# EAGLE design Interface_V1.0 (EAGLE 9.4.1)

## Sheet 1 of 2
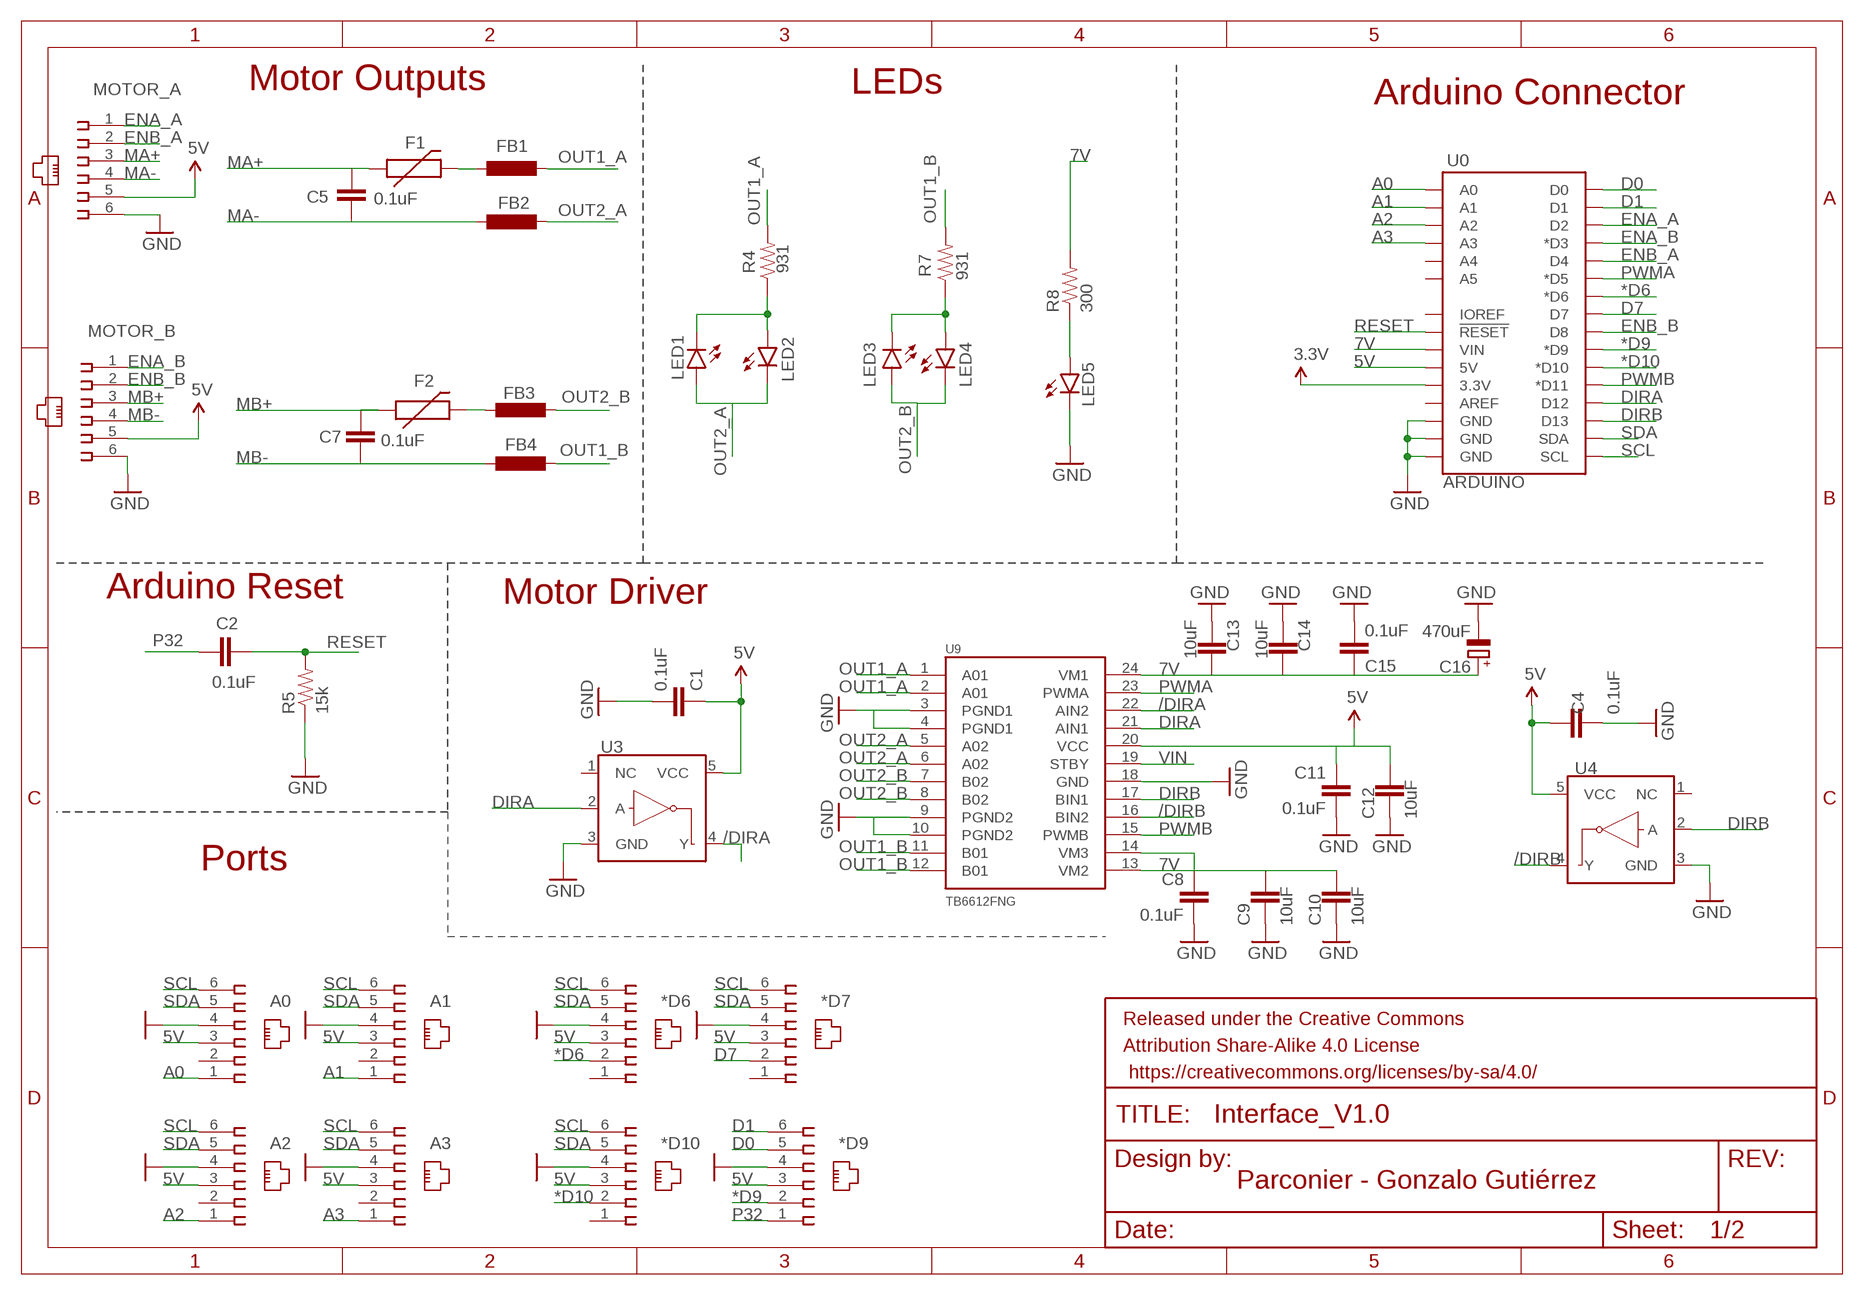
[diagram p0: schematic, sheet 1]

### Parts
*D6  615006138421  [615006138421]
*D7  615006138421  [615006138421]
*D9  615006138421  [615006138421]
*D10  615006138421  [615006138421]
A0  615006138421  [615006138421]
A1  615006138421  [615006138421]
A2  615006138421  [615006138421]
A3  615006138421  [615006138421]
C1  0.1uF  CAP_0402  [0402]
C2  0.1uF  CAP_0402  [0402]
C4  0.1uF  CAP_0402  [0402]
C5  0.1uF  CAP_0402  [0402]
C7  0.1uF  CAP_0402  [0402]
C8  0.1uF  CAP_0402  [0402]
C9  10uF  C-EUC0603  [C0603]
C10  10uF  C-EUC0603  [C0603]
C11  0.1uF  CAP_0402  [0402]
C12  10uF  C-EUC0603  [C0603]
C13  10uF  C-EUC0603  [C0603]
C14  10uF  C-EUC0603  [C0603]
C15  0.1uF  CAP_0402  [0402]
C16  470uF  CPOL-EUE  [PANASONIC_E]
F1  PTC  [PTC-1206]
F2  PTC  [PTC-1206]
FB1  FERRITE_BEAD  [F0805]
FB2  FERRITE_BEAD  [F0805]
FB3  FERRITE_BEAD  [F0805]
FB4  FERRITE_BEAD  [F0805]
LED1  LED0603  [LED-0603]
LED2  LED0603  [LED-0603]
LED3  LED0603  [LED-0603]
LED4  LED0603  [LED-0603]
LED5  LED0603  [LED-0603]
MOTOR_A  615006138421  [615006138421]
MOTOR_B  615006138421  [615006138421]
R4  931  RES_0402  [RESC1005X35]
R5  15k  RES_0402  [RESC1005X35]
R7  931  RES_0402  [RESC1005X35]
R8  300  RES_0402  [RESC1005X35]
U0  ARDUINO  ARDUINO_R3_NO_SPI  [ARDUINO_R3_NO_HOLES_SPI]
U3  INVERTER""  [SC70]
U4  INVERTER""  [SC70]
U9  TB6612FNG  [SSOP24]

### Nets
3.3V: U0.3.3V
5V: *D6.3 *D7.3 *D9.3 *D10.3 A0.3 A1.3 A2.3 A3.3 C1.1 C4.1 C11.1 C12.1 MOTOR_A.5 MOTOR_B.5 U0.5V U3.5(VCC) U4.5(VCC) U9.20(VCC)
7V: C8.1 C9.1 C10.1 C13.1 C14.1 C15.1 C16.+ R8.2 U0.VIN U9.13(VM2) U9.14(VM3) U9.24(VM1) ; also sheet 2
*D6: *D6.2 U0.D6(*D6)
*D9: *D9.2 U0.D9(*D9)
*D10: *D10.2 U0.D10(*D10)
/DIRA: U3.4(Y) U9.22(AIN2)
/DIRB: U4.4(Y) U9.16(BIN2)
A0: A0.1 U0.A0
A1: A1.1 U0.A1
A2: A2.1 U0.A2
A3: A3.1 U0.A3
D0: *D9.5 U0.D0
D1: *D9.6 U0.D1
D7: *D7.2 U0.D7
DIRA: U0.D12 U3.2(A) U9.21(AIN1)
DIRB: U0.D13 U4.2(A) U9.17(BIN1)
ENA_A: MOTOR_A.1 U0.D2
ENA_B: MOTOR_B.1 U0.D3(*D3)
ENB_A: MOTOR_A.2 U0.D4
ENB_B: MOTOR_B.2 U0.D8
GND [gnd]: *D6.4 *D7.4 *D9.4 *D10.4 A0.4 A1.4 A2.4 A3.4 C1.2 C4.2 C8.2 C9.2 C10.2 C11.2 C12.2 C13.2 C14.2 C15.2 C16.- LED5.C MOTOR_A.6 MOTOR_B.6 R5.1 U0.GND@1(GND) U0.GND@2(GND) U0.GND@3(GND) U3.3(GND) U4.3(GND) U9.3(PGND1) U9.4(PGND1) U9.9(PGND2) U9.10(PGND2) U9.18(GND) ; also sheet 2
MA+: C5.1 F1.1 MOTOR_A.3
MA-: C5.2 FB2.1 MOTOR_A.4
MB+: C7.1 F2.1 MOTOR_B.3
MB-: C7.2 FB4.1 MOTOR_B.4
N$7: LED1.C LED2.A R4.1
N$12: LED3.C LED4.A R7.1
N$13: F1.2 FB1.1
N$27: F2.2 FB3.1
N$30: LED5.A R8.1
OUT1_A: FB1.2 R4.2 U9.1(A01) U9.2(A01)
OUT1_B: FB4.2 R7.2 U9.11(B01) U9.12(B01)
OUT2_A: FB2.2 LED1.A LED2.C U9.5(A02) U9.6(A02)
OUT2_B: FB3.2 LED3.A LED4.C U9.7(B02) U9.8(B02)
P32: *D9.1 C2.1
PWMA: U0.D5(*D5) U9.23(PWMA)
PWMB: U0.D11(*D11) U9.15(PWMB)
RESET: C2.2 R5.2 U0.RESET@1(!RESET!)
SCL: *D6.6 *D7.6 *D10.6 A0.6 A1.6 A2.6 A3.6 U0.SCL
SDA: *D6.5 *D7.5 *D10.5 A0.5 A1.5 A2.5 A3.5 U0.SDA
VIN: U9.19(STBY) ; also sheet 2
Unconnected: *D6.1 *D7.1 *D10.1 A0.2 A1.2 A2.2 A3.2 U0.A4 U0.A5 U0.AREF U0.IOREF U3.1(NC) U4.1(NC)

### Notes on the sheet
- Motor Outputs | LEDs
- Arduino Connector
- Arduino Reset | Motor Driver
- Ports

## Sheet 2 of 2
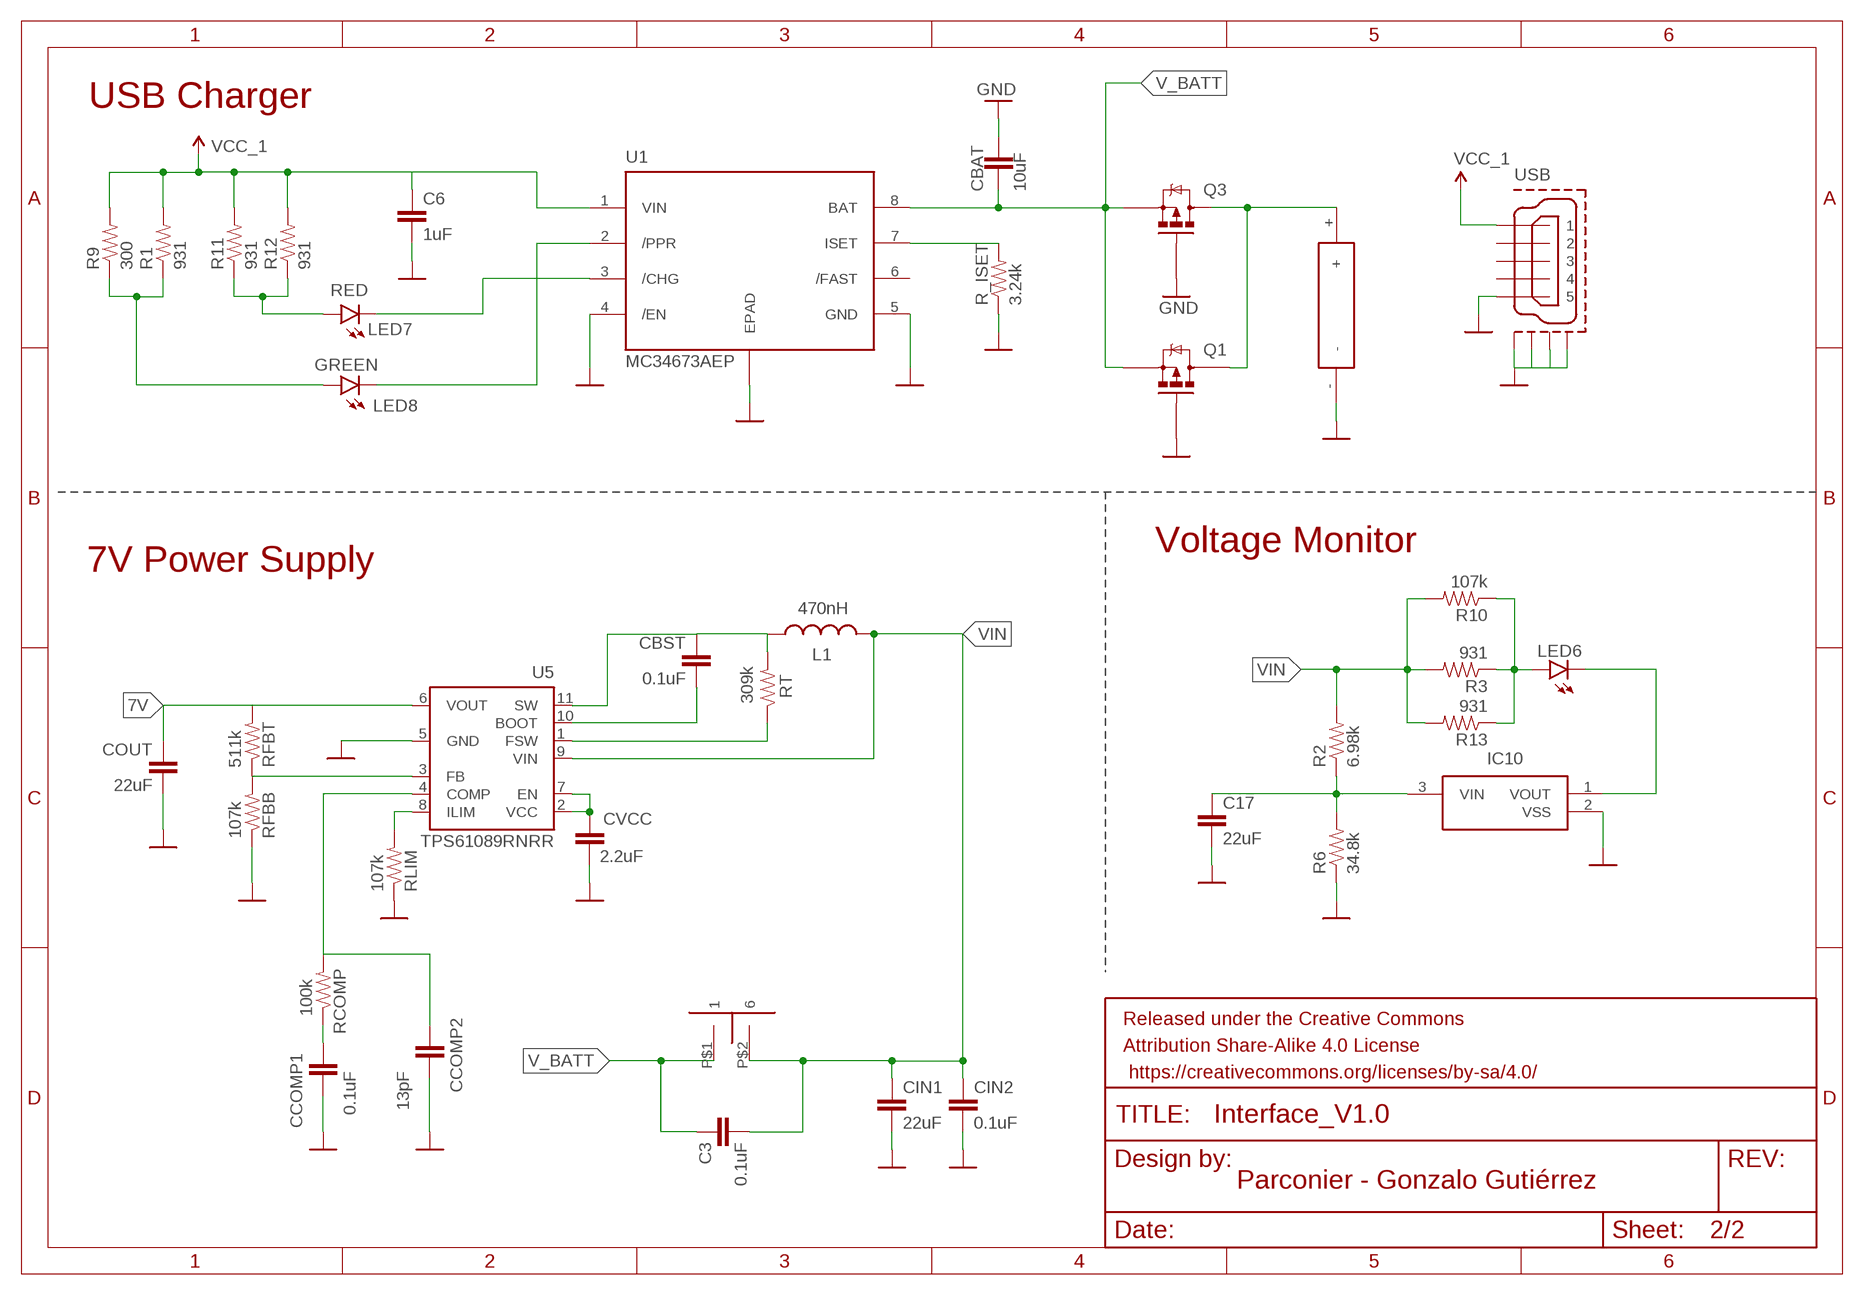
[diagram p1: schematic, sheet 2]

### Parts
B1  GPTS203212B  [GPTS_RIGHT_ANGLE]
BATT  BATTERY  [THM_HOLDER]
C3  0.1uF  CAP_0402  [0402]
C6  1uF  CAP_0402  [0402]
C17  22uF  C-EUC0603  [C0603]
CBAT  10uF  C-EUC0603  [C0603]
CBST  0.1uF  CAP_0402  [0402]
CCOMP1  0.1uF  CAP_0402  [0402]
CCOMP2  13pF  CAP_0402  [0402]
CIN1  22uF  C-EUC0603  [C0603]
CIN2  0.1uF  CAP_0402  [0402]
COUT  22uF  C-EUC1210  [C1210]
CVCC  2.2uF  C-EUC0603  [C0603]
IC10  TC54VN3002ECB713  [SOT95P275X130-3N]
L1  470nH  L-USL2520  [L2520]
LED6  LED0603  [LED-0603]
LED7  LED0603  [LED-0603]
LED8  LED0603  [LED-0603]
Q1  IRLML2244TRPBF  [SOT95P237X112-3N]
Q3  IRLML2244TRPBF  [SOT95P237X112-3N]
R1  931  RES_0402  [RESC1005X35]
R2  6.98k  RES_0402  [RESC1005X35]
R3  931  RES_0402  [RESC1005X35]
R6  34.8k  RES_0402  [RESC1005X35]
R9  300  RES_0402  [RESC1005X35]
R10  107k  RES_0402  [RESC1005X35]
R11  931  RES_0402  [RESC1005X35]
R12  931  RES_0402  [RESC1005X35]
R13  931  RES_0402  [RESC1005X35]
R_ISET  3.24k  RES_0402  [RESC1005X35]
RCOMP  100k  RES_0402  [RESC1005X35]
RFBB  107k  RES_0402  [RESC1005X35]
RFBT  511k  RES_0402  [RESC1005X35]
RLIM  107k  RES_0402  [RESC1005X35]
RT  309k  RES_0402  [RESC1005X35]
U1  MC34673AEP  [SOT1590-2]
U5  TPS61089RNRR  [VQFN-11]
USB  MOLEX-47346-0001MOKO  [A01SBXXXXXXX-470-MOKO]

### Nets
7V: COUT.1 RFBT.2 U5.6(VOUT) ; also sheet 1
GND [gnd]: BATT.- C6.2 C17.2 CBAT.1 CCOMP1.2 CCOMP2.2 CIN1.2 CIN2.2 COUT.2 CVCC.2 IC10.2(VSS) Q1.1(G) Q3.1(G) R6.1 R_ISET.1 RFBB.1 RLIM.1 U1.4(/EN) U1.5(GND) U1.9(EPAD) U5.5(GND) USB.5 USB.GND1 USB.GND2 USB.GND3 USB.GND4 USB.GND5(GND3) USB.GND6(GND3) ; also sheet 1
GREEN: LED8.C U1.2(/PPR)
N$1: LED7.A R11.1 R12.1
N$2: LED8.A R1.1 R9.1
N$4: IC10.1(VOUT) LED6.C
N$5: C17.1 IC10.3(VIN) R2.1 R6.2
N$6: LED6.A R3.1 R10.1 R13.1
N$15: R_ISET.2 U1.7(ISET)
N$32: CVCC.1 U5.2(VCC) U5.7(EN)
N$33: CBST.1 L1.2 RT.2 U5.11(SW)
N$34: RT.1 U5.1(FSW)
N$35: CBST.2 U5.10(BOOT)
N$36: RFBB.2 RFBT.1 U5.3(FB)
N$37: CCOMP2.1 RCOMP.2 U5.4(COMP)
N$38: CCOMP1.1 RCOMP.1
N$39: RLIM.2 U5.8(ILIM)
RED: LED7.C U1.3(/CHG)
V_B [power]: BATT.+ Q1.3(D) Q3.3(D)
V_BATT [power]: B1.P$1 C3.1 CBAT.2 Q1.2(S) Q3.2(S) U1.8(BAT)
VCC_1: C6.1 R1.2 R9.2 R11.2 R12.2 U1.1(VIN) USB.1
VIN: B1.P$2 C3.2 CIN1.1 CIN2.1 L1.1 R2.2 R3.2 R10.2 R13.2 U5.9(VIN) ; also sheet 1
Unconnected: U1.6(/FAST) USB.2 USB.3 USB.4

### Notes on the sheet
- USB Charger
- RED
- GREEN
- Voltage Monitor
- 7V Power Supply

## Library data of the parts
*D6 *D7 *D9 *D10 A0 A1-A3 = 615006138421:615006138421: HORIZONTAL PLASTIC 6P6C MODULAR JACK TAP UP Source: Datasheet <http://docs-europe.electrocomponents.com/webdocs/0f88/0900766b80f88670.pdf>; DESCRIPTION: HORIZONTAL PLASTIC 6P6C MODULAR JACK TAP UP; HEIGHT: mm; MANUFACTURER_NAME: W&uuml;rth Elektronik; MANUFACTURER_PART_NUMBER: 615006138421; MPNCH: 623-PCB-6P6C; RS_PART_NUMBER: 7350282; SUPPLIER_NAME: RS
B1 = Button:GPTS203212B: Push Button Switch; MPN: GPTS203212B; MPNCH: 1212-112YB
BATT = batteryHolder:BATTERY: Battery Holder; MPN: 1043
C1-C5 C7 C8 C11 C15 CBST CCOMP1 CIN2 = Perfect_0402:CAP_0402: 0402 (1005 Metric) Nick Garner - TeleSense; MPN: CC0402KRX5R9BB104
C6 = Perfect_0402:CAP_0402: 0402 (1005 Metric) Nick Garner - TeleSense; MPN: CC0402ZRY5V6BB105
C9 C10 C12-C14 CBAT = rcl:C-EU: Capacitor; MPN: ZRB18AR61E106ME01L
C16 = rcl:CPOL-EU: POLARIZED CAPACITOR, European symbol; MPN: EDH477M016A9MAA
C17 CIN1 = rcl:C-EU: Capacitor; MPN: GRM188R61A226ME15D
CCOMP2 = Perfect_0402:CAP_0402: 0402 (1005 Metric) Nick Garner - TeleSense; MPN: CL05C130JB5NCNC
COUT = rcl:C-EU: Capacitor; MPN: GRM32ER61E226KE15L
CVCC = rcl:C-EU: Capacitor; MPN: GRM188R61E225MA12D
F1 F2 = PTC:PTC; MPN: 0ZCJ0100FF2E
FB1-FB4 = ferrite:FERRITE_BEAD; MPN: 2508056017Y2
IC10 = TC54VN3002ECB713:TC54VN3002ECB713: MICROCHIP - TC54VN3002ECB713 - VOLTAGE DETECTOR, 1.1 uA, 10V, 3-SOT-23A Source: Datasheet <https://componentsearchengine.com/Datasheets/2/TC54VN3002ECB713.pdf>; DESCRIPTION: MICROCHIP - TC54VN3002ECB713 - VOLTAGE DETECTOR, 1.1 uA, 10V, 3-SOT-23A; HEIGHT: 1.3mm; MANUFACTURER_NAME: Microchip; MANUFACTURER_PART_NUMBER: TC54VN3002ECB713; MPN: TC54VN3002ECB713
L1 = rcl:L-US: INDUCTOR; MPN: DFE252012P-R47M=P2
LED1-LED4 LED6 LED7 = SparkFun-LED:LED: LEDs Standard schematic elements and footprints for 5mm, 3mm, 1206, and 0603 sized LEDs. 5mm - Spark Fun Electronics SKU : COM-00529 (and others); MPN: LTST-C193KRKT-5A
LED5 = SparkFun-LED:LED: LEDs Standard schematic elements and footprints for 5mm, 3mm, 1206, and 0603 sized LEDs. 5mm - Spark Fun Electronics SKU : COM-00529 (and others); MPN: LW Q38G-Q2OO-3K5L-1
LED8 = SparkFun-LED:LED: LEDs Standard schematic elements and footprints for 5mm, 3mm, 1206, and 0603 sized LEDs. 5mm - Spark Fun Electronics SKU : COM-00529 (and others); MPN: LT Q39E-Q1OO-25-1
MOTOR_A MOTOR_B = 615006138421:615006138421: HORIZONTAL PLASTIC 6P6C MODULAR JACK TAP UP Source: Datasheet <http://docs-europe.electrocomponents.com/webdocs/0f88/0900766b80f88670.pdf>; DESCRIPTION: HORIZONTAL PLASTIC 6P6C MODULAR JACK TAP UP; HEIGHT: mm; MANUFACTURER_NAME: W&uuml;rth Elektronik; MANUFACTURER_PART_NUMBER: 615006138421; MPNCH: 9901-6P6C; RS_PART_NUMBER: 7350282; SUPPLIER_NAME: RS
Q1 Q3 = IRLML2244TRPBF:IRLML2244TRPBF: HEXFET Power MOSFET Source: Datasheet; ARROW_PART_NUMBER: IRLML2244TRPBF; DESCRIPTION: HEXFET Power MOSFET; HEIGHT: mm; MANUFACTURER_NAME: International Rectifier; MANUFACTURER_PART_NUMBER: IRLML2244TRPBF; MPN: IRLML2244TRPBF
R1 R3 R4 R7 R11-R13 = Perfect_0402:RES_0402; MPN: RC0402FR-07931RL
R2 = Perfect_0402:RES_0402; MPN: RC0402FR-076K98L
R5 = Perfect_0402:RES_0402; MPN: RC0402FR-0715KL
R6 = Perfect_0402:RES_0402; MPN: RC0402FR-0734K8L
R8 R9 = Perfect_0402:RES_0402; MPN: RC0402JR-07300RL
R10 RFBB RLIM = Perfect_0402:RES_0402; MPN: RC0402FR-07107KL
R_ISET = Perfect_0402:RES_0402; MPN: RC0402FR-073K24L
RCOMP = Perfect_0402:RES_0402; MPN: RC0402FR-07100KL
RFBT = Perfect_0402:RES_0402; MPN: RC0402FR-07511KL
RT = Perfect_0402:RES_0402; MPN: AC0402FR-07309KL
U0 = SparkFun-Boards:ARDUINO_R3_NO_SPI
U1 = freescale:MC34673AEP; MPN: MC34673AEPR2
U3 U4 = SparkFun:INVERTER: Single inverter, SOT23-5; MPN: 74AHC1G14GW-Q100,1
U5 = Texas:TPS61089RNRR: Voltage Regulators - Switching Regulators; MPN: TPS61089RNRR
U9 = TB6612FNG:TB6612FNG; MPN: TB6612FNG,C,8,EL
USB = usb_con-update:MOLEX-47346-0001: MICRO USB B, BOTTOM MOUNT; MPN: 0473460001

## Net classes
0 Default: width 0.203 mm, drill 0.305 mm
1 power: width 0.61 mm
2 gnd: width 0.305 mm, drill 0.305 mm, clearance 0.229 mm

## Board
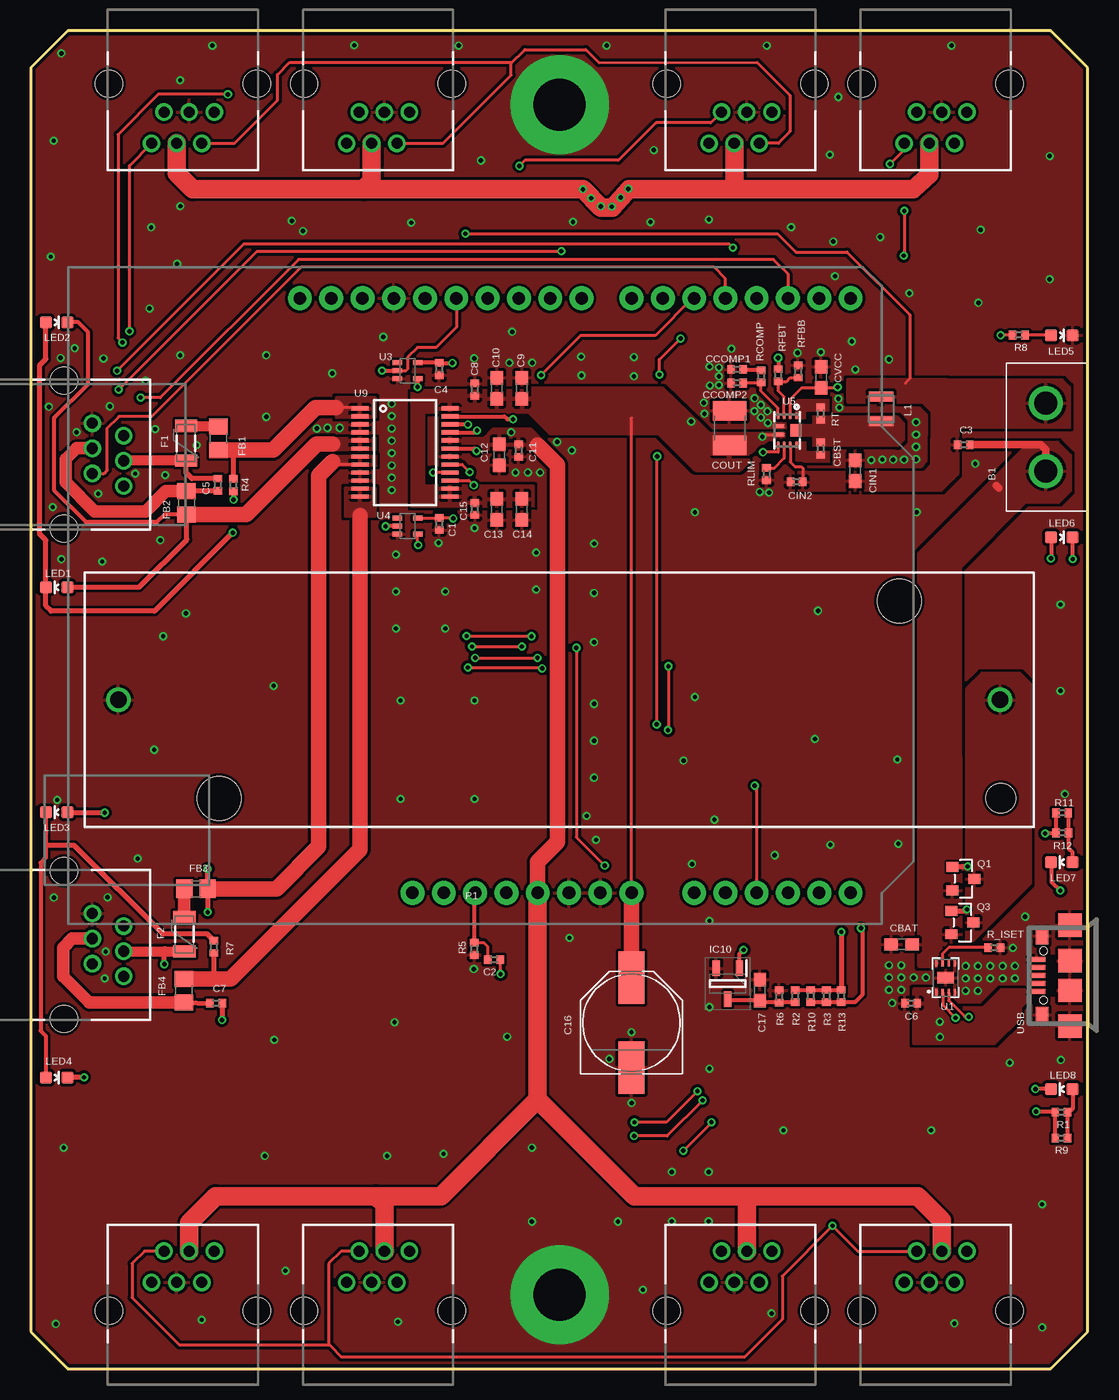
[diagram p2: board, top side]
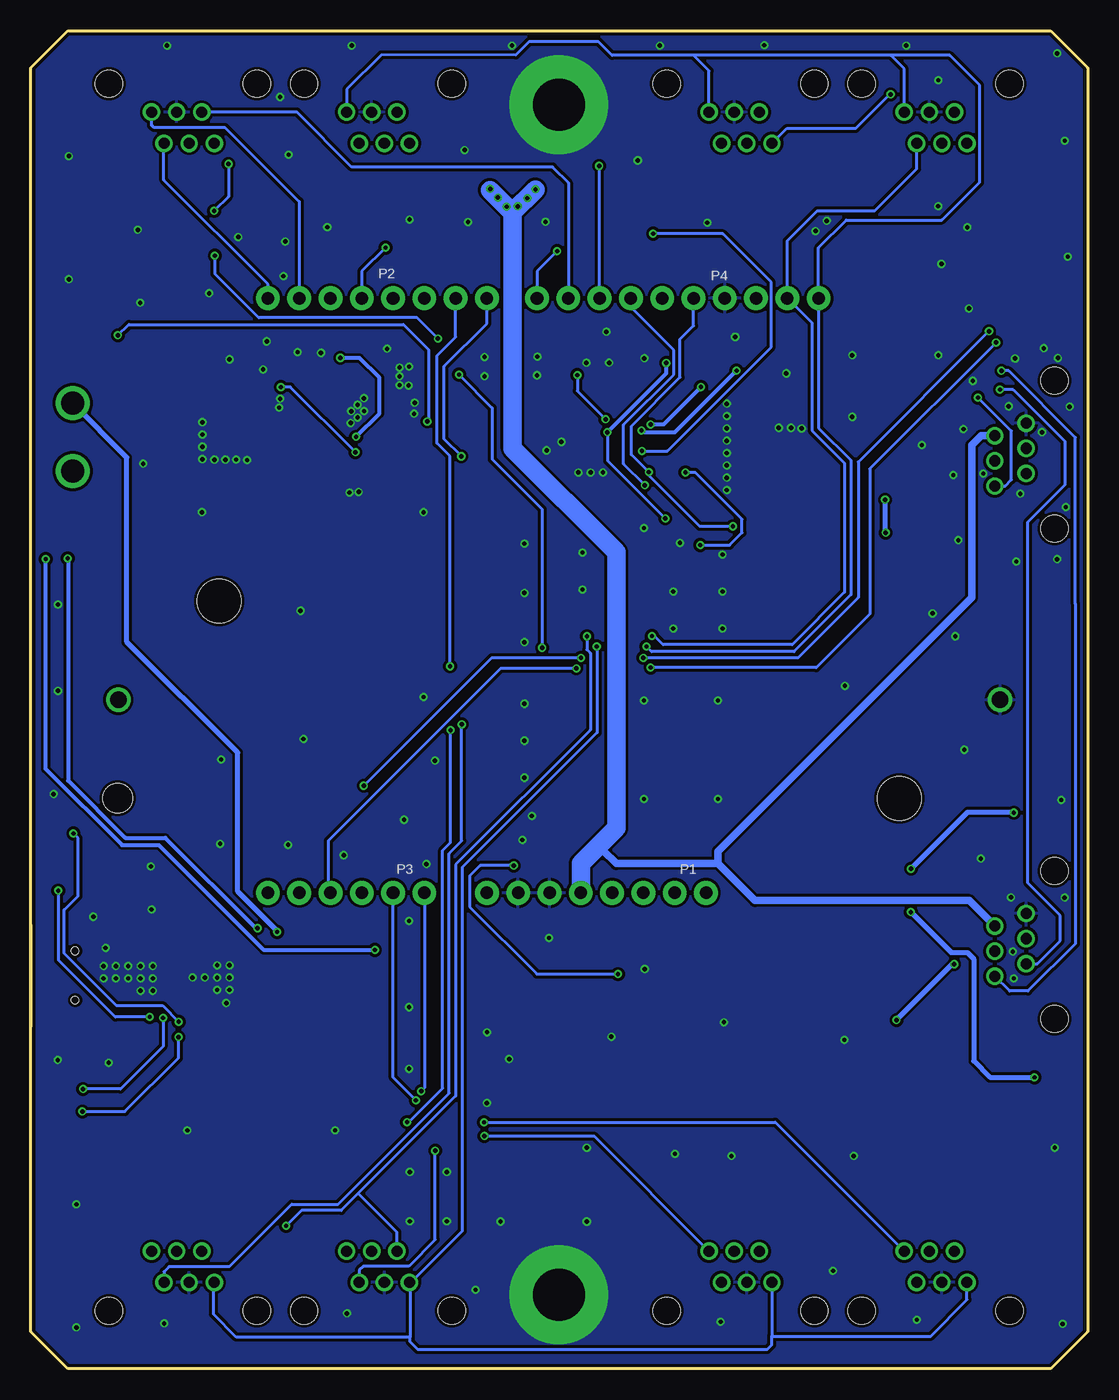
[diagram p3: board, bottom side, seen from below]

Size 85.8 x 108.6 mm. Coordinates in mm from the lower left corner, seen from the top.
Outline: 85.8,36.06 85.8,27.76
Outline: 0,105.6 0,3 3,0 82.8,0 85.8,3 85.8,105.6 82.8,108.6 3,108.6 0,105.6
Copper layers (1*16): Top 0.035mm / dielectric 1.5mm / Bottom 0.035mm
Design rules "SeeedStudio_2layer_DRU_no_angle_20140221 *": minimum track width 6mil, minimum drill 12mil, track to track 6mil, track to pad 6mil, pad to pad 6mil, via to via 6mil, smd to smd 0mil, copper to edge 10mil, drill to drill 10mil, minimum pad ring 10mil, minimum via ring 6mil, stop-mask expansion 2mil, vias tented up to drill 200mil, thermal gap 10mil

### Footprints (pad centres in the part's own frame; a part is rotated, then mirrored left to right if it is on the bottom)
615006138421 = drill 0.9 pad 1.4: 1 2.55,4.84; 2 1.53,2.3; 3 0.51,4.84; 4 -0.51,2.3; 5 -1.53,4.84; 6 -2.55,2.3 | hole 2.2: -6,0; 6,0
GPTS_RIGHT_ANGLE = drill 1.85: P$1 -2.75,0; P$2 2.75,0
THM_HOLDER = drill 1.32: + 35.79,0; - -35.79,0 | hole 3.55: 27.62,8; -27.62,-8 | hole 2.39: 35.84,-8
0402 = smd 0.6 x 0.7: 1 -0.5,0; 2 0.5,0
C0603 = smd 1.1 x 1: 1 -0.85,0; 2 0.85,0
PANASONIC_E = smd 4.25 x 2.1: + 3.65,0; - -3.65,0
C1210 = smd 1.6 x 2.7: 1 -1.4,0; 2 1.4,0
PTC-1206 = smd 1 x 1.8: 1 -1.4,0; 2 1.4,0
F0805 = smd 1.3 x 1.5: 1 -0.95,0; 2 0.95,0
SOT95P275X130-3N = smd 1.25 x 0.6: 1 -1.25,0.95; 2 -1.25,-0.95; 3 1.25,0
L2520 = smd 0.8 x 2: 1 -1,0; 2 1,0
LED-0603 = smd 1 x 1: A 0,-0.877; C 0,0.877
SOT95P237X112-3N = smd 0.972 x 0.802: 1 -0.885,0.95; 2 -0.885,-0.95; 3 0.885,0
RESC1005X35 = smd 0.6 x 0.7: 1 -0.5,0; 2 0.5,0
ARDUINO_R3_NO_HOLES_SPI = drill 1.016 pad 1.93: 3.3V 35.56,2.54; 5V 38.1,2.54; A0 50.8,2.54; A1 53.34,2.54; A2 55.88,2.54; A3 58.42,2.54; A4 60.96,2.54; A5 63.5,2.54; AREF 23.876,50.8; D0 63.5,50.8; D1 60.96,50.8; D2 58.42,50.8; D3 55.88,50.8; D4 53.34,50.8; D5 50.8,50.8; D6 48.26,50.8; D7 45.72,50.8; D8 41.656,50.8; D9 39.116,50.8; D10 36.576,50.8; D11 34.036,50.8; D12 31.496,50.8; D13 28.956,50.8; GND@1 40.64,2.54; GND@2 43.18,2.54; GND@3 26.416,50.8; IOREF 30.48,2.54; NC 27.94,2.54; RESET@1 33.02,2.54; SCL 18.796,50.8; SDA 21.336,50.8; VIN 45.72,2.54
SOT1590-2 = smd 0.25 x 0.6: 1 -0.75,-1.2; 2 -0.25,-1.2; 3 0.25,-1.2; 4 0.75,-1.2; 5 0.75,1.2; 6 0.25,1.2; 7 -0.25,1.2; 8 -0.75,1.2 | smd 1.33 x 0.93: 9 0,0
SC70 = smd 0.4 x 0.75: 1 -0.65,-0.825; 2 0,-0.825; 3 0.65,-0.825; 4 0.65,0.825; 5 -0.65,0.825
VQFN-11 = smd 0.25 x 0.55: 1 -0.75,-1.175; 2 -0.25,-1.175; 3 0.25,-1.175; 4 0.75,-1.175; 7 0.75,1.175; 8 0.25,1.175; 9 -0.25,1.175; 10 -0.75,1.175 | smd 1 x 0.35: 5 0.7,-0.35; 6 0.7,0.35 | smd 1 x 1: 11 -0.7,0
SSOP24 = smd 0.348 x 1.397: 1 -3.575,-3.656; 2 -2.925,-3.656; 3 -2.275,-3.656; 4 -1.625,-3.656; 5 -0.975,-3.656; 6 -0.325,-3.656; 7 0.325,-3.656; 8 0.975,-3.656; 9 1.625,-3.656; 10 2.275,-3.656; 11 2.925,-3.656; 12 3.575,-3.656; 13 3.575,3.656; 14 2.925,3.656; 15 2.275,3.656; 16 1.625,3.656; 17 0.975,3.656; 18 0.325,3.656; 19 -0.325,3.656; 20 -0.975,3.656; 21 -1.625,3.656; 22 -2.275,3.656; 23 -2.925,3.656; 24 -3.575,3.656
A01SBXXXXXXX-470-MOKO = smd 1.35 x 0.4: 1 2.675,1.3; 2 2.675,0.65; 3 2.675,0; 4 2.675,-0.65; 5 2.675,-1.3 | smd 1.9 x 1.9: GND1 0,4.1; GND4 0,-4.1; GND5 0,-1.2; GND6 0,1.2 | smd 1 x 1.35: GND2 2.25,3.2; GND3 2.25,-3.2 | hole 0.6: 2.15,2; 2.15,-2

### Placement (x,y rotation side)
*D6  57.61,4.7 0 top
*D7  73.45,4.7 0 top
*D9  73.45,104.3 180 top
*D10  57.61,104.3 180 top
A0  12.35,4.7 0 top
A1  28.19,4.7 0 top
A2  12.35,104.3 180 top
A3  28.19,104.3 180 top
B1  82.4,75.62 90 top
BATT  42.9,54.3 0 top
C1  33.15,68.58 270 top
C2  37.61,33.22 180 top
C3  75.73,75 180 top
C4  33.15,81.14 270 top
C5  15.19,71.75 270 top
C6  71.47,29.67 180 top
C7  15.04,29.67 180 top
C8  36.05,79.48 90 top
C9  39.86,79.59 90 top
C10  37.83,79.59 90 top
C11  39.61,74.53 270 top
C12  38.04,74.18 270 top
C13  37.83,69.75 270 top
C14  39.86,69.75 270 top
C15  36.05,69.79 270 top
C16  48.76,28.09 90 top
C17  59.19,30.74 90 top
CBAT  70.69,34.44 0 top
CBST  64.11,74.69 270 top
CCOMP1  57.33,81.11 180 top
CCOMP2  57.34,80 180 top
CIN1  66.93,72.9 90 top
CIN2  62.17,71.98 180 top
COUT  56.73,76.36 90 top
CVCC  64.15,80.47 90 top
F1  12.6,75.12 90 top
F2  12.47,35.27 90 top
FB1  15.24,75.52 270 top
FB2  12.65,70.28 270 top
FB3  13.42,38.95 0 top
FB4  12.44,30.68 90 top
IC10  56.58,31.26 270 top
L1  69.03,77.9 270 top
LED1  2.1,63.43 90 top
LED2  2.1,84.94 270 top
LED3  2.1,45.17 90 top
LED4  2.1,23.63 270 top
LED5  83.7,83.89 270 top
LED6  83.7,67.49 270 top
LED7  83.7,41.12 90 top
LED8  83.7,22.7 90 top
MOTOR_A  2.7,74.2 270 top
MOTOR_B  2.7,34.4 270 top
Q1  75.71,39.77 0 top
Q3  75.63,36.22 0 top
R1  83.67,20.83 180 top
R2  62.05,30.24 90 top
R3  64.58,30.25 90 top
R4  16.45,71.72 90 top
R5  36.01,34.08 90 top
R6  60.74,30.22 270 top
R7  14.86,34.25 270 top
R8  80.2,83.9 180 top
R9  83.67,18.73 180 top
R10  63.32,30.25 90 top
R11  83.72,45.11 180 top
R12  83.74,43.49 180 top
R13  65.79,30.25 90 top
R_ISET  78.22,34.18 180 top
RCOMP  59.28,80.55 270 top
RFBB  62.29,80.95 270 top
RFBT  60.67,80.64 90 top
RLIM  59.72,72.61 90 top
RT  64.13,77.52 270 top
U0  3.05,36.09 0 top
U1  74.27,31.74 0 top
U3  30.58,81.01 270 top
U4  30.58,68.4 270 top
U5  61.4,76.17 180 top
U9  30.38,74.37 270 top
USB  84.35,31.91 180 top

### Tracks (layer width: path | path; a pad name or v marks a point on that pad's centre or on a via)
5V  (via drill 0.35 pad 0.35)
  Top 0.203: 47.2,94.26 47,94.06 47,94 46.62,94 46.36,94.26 | v46.27,94.35 46.27,94.29 46.3,94.26
  Top 0.254: U4.5 33.13,69.05 C1.1 34.23,69.08 v34.29,69.02 | 47.2,94.26 47.17,94.29 v47.17,94.33 47.1,94.26 46.36,94.26 | v47.88,95.07 47.91,95.07 48.57,95.73 | C4.1 33.13,81.66
  Top 0.305: 33.13,81.66 U3.5 | C4.1 v34.22,81.64
  Top 1.27: 41.14,74.97 42.75,73.36 42.75,42.75 41.15,41.15 U0.5V
  Top 1.5: *D7.3 73.96,12.04 72,14 58,14 | 58,14 49,14 41.15,21.85 | 41.15,21.85 U0.5V | A0.3 12.86,11.86 15,14 28,14 | 28,14 33.3,14 41.15,21.85 | A1.3 28.7,13.3 28,14 | *D6.3 58.12,13.88 58,14 | 27,95.73 v44.83,95.73 46.3,94.26 46.36,94.26 47.2,94.26 48.57,95.73 57.12,95.73 | 27,95.73 13.16,95.73 11.84,97.05 A2.3 | A3.3 27.68,96.41 27,95.73 | 57.12,95.73 71.64,95.73 72.94,96.93 *D9.3 | *D10.3 57.1,95.75 57.12,95.73
  Bottom 0.203: 46.69,93.82 46.69,93.86 | v44.83,95.73 v44.84,95.72 44.84,95.71
  Bottom 0.254: v34.29,69.02 38.97,73.7 38.97,75.98 v39,76.01 | v48.51,95.77 48.51,95.7 48.54,95.67
  Bottom 0.305: v34.22,81.64 34.22,80.79 v39,76.01 | v44.83,95.73 44.83,95.67 v45.49,95.01
  Bottom 0.61: 30,41 27,38 9.61,38 MOTOR_B.5 | 30,41 38.27,41 39.34,42.08 40.08,42.08 | 30,41 30,42 9.41,62.59 9.41,74.96 8.64,75.73 MOTOR_A.5
  Bottom 1.5: U0.5V 41.15,41 40.08,42.08 38.27,43.88 38.27,66.27 46.69,74.69 46.69,93.86 44.84,95.71 | 48.54,95.67 46.69,93.82
  pour Top: 33.49,74.65 33.49,75.5 36.82,75.5 37.58,76.26 40.55,76.26 41.39,75.42 41.23,74.65
7V  (via drill 0.35, 0.35 pad 0.35)
  Top 0.254: 59.39,75.66 59.54,75.81 U5.6 | U0.VIN 48.77,77.2 | R8.2 78.75,83.9 v78.73,83.88
  Top 0.305: v60.67,82.05 RFBT.2
  Top 1.27: U0.VIN C16.+
  Bottom 0.254: v78.73,83.88 77.85,84.76 55.54,84.76 53.49,82.71 53.49,77.01 v53.61,76.89
  Bottom 0.305: v59.4,75.65 57.5,77.55 57.5,80.43 59.12,82.05 v60.67,82.05
  pour Top: 40.78,71.59 31.87,71.59 31.87,77.69 40.61,77.69 40.61,79.34 30.94,79.34 30.94,70.06 40.78,70.06
  pour Top: 55.44,75.44 51.25,79.51 40.63,79.51 40,78.88 40,78.17 42.17,76 51,76 54,73 57.51,72.99 58.3,73.75 58.3,75.51
  pour Top (isolate 0.254, no thermals): 61.25,75.97 55.11,75.97 54.65,75.51 54.65,74.17 58.28,74.17 59.91,75.34 61.25,75.34
*D6  (via drill 0.35 pad 0.35)
  Top 0.254: v52.97,17.7 52.99,17.7 55.25,19.96 v55.25,20.01 | v51.73,51.83 51.75,51.85 51.75,57.02 v51.77,57.02
  Bottom 0.254: v52.97,17.7 52.97,10.47 55.11,8.33 58.82,8.33 59.14,8.01 *D6.2 | v55.25,20.01 55.12,20.01 52.37,22.76 52.37,42.08 51.73,42.72 v51.73,51.83 | v51.77,57.02 51.77,74.06 52.84,75.13 52.84,82.23 51.31,83.75 U0.D6
*D9
  Bottom 0.254: U0.D9 42.17,96.27 43.44,97.54 59.74,97.54 64.2,102 *D9.2
*D10  (via drill 0.35 pad 0.35)
  Top 0.254: v39.66,97.63 40.11,98.08 47.7,98.08 50.75,101.13 55.21,101.13 *D10.2
  Bottom 0.254: v39.66,97.63 39.66,86.92 U0.D10
/DIRA  (via drill 0.35 pad 0.35)
  Top 0.254: U3.4
  Top 0.305: U3.4 v31.41,79.7 v31.4,79.69 | v35.48,76.65 U9.22
  Bottom 0.305: v31.4,79.69 34.44,76.65 v35.48,76.65
/DIRB  (via drill 0.35 pad 0.35)
  Top 0.254: U9.16 v32.66,72.75 v32.65,72.75 | v31.45,66.85 31.41,66.89 U4.4
  Bottom 0.254: v31.45,66.85 29.08,66.85 28.06,67.87 28.06,68.96 31.85,72.75 v32.65,72.75
A0  (via drill 0.35 pad 0.35)
  Top 0.254: v54.11,22.52 51.59,20 v49,20
  Bottom 0.254: U0.A0 53.85,22.78 v54.11,22.52 | v49,20 25.36,20 A0.1
A1  (via drill 0.35 pad 0.35)
  Top 0.254: v54.54,21.78 v54.55,21.77 51.66,18.89 v48.98,18.89
  Bottom 0.254: U0.A1 56.39,23.63 v54.54,21.78 | v48.98,18.89 40.09,18.89 A1.1
A2  (via drill 0.35 pad 0.35)
  Top 0.254: v36.08,57.7 v41.13,57.7 | U0.A2 58.93,47.16 v58.77,47.32 | v8.01,84.21 8.01,97.67 A2.1
  Bottom 0.254: v8.01,84.21 18.62,73.6 18.62,62.6 23.52,57.7 v36.08,57.7 | v41.13,57.7 48.39,57.7 v58.77,47.32
A3  (via drill 0.35, 0.35 pad 0.35)
  Top 0.254: v16,103.44 10.34,103.44 7.08,100.18 7.08,83.66 v7.44,83.3 | v35.48,56.91 41.45,56.91 v41.51,56.85
  Bottom 0.254: v7.44,83.3 17.69,73.05 17.69,61.25 22.03,56.91 v35.48,56.91 | v41.51,56.85 47.65,56.85 61.65,42.85 61.65,38.81 U0.A3 | v16,103.44 16.08,103.44 18.83,100.69 24.41,100.69 A3.1
D0
  Bottom 0.254: U0.D0 66.55,88.03 75,96.48 75,99.44 *D9.5
D1
  Bottom 0.254: U0.D1 64.01,94.73 70.03,100.75 75.82,100.75 75.99,100.92 *D9.6
D7  (via drill 0.35 pad 0.35)
  Top 0.254: v50.81,52.31 50.81,74.02 v50.85,74.06
  Bottom 0.254: v50.81,52.31 50.81,42.85 51.84,41.82 51.84,22.37 60.85,13.36 64.61,13.36 69.69,8.28 74.57,8.28 74.98,7.87 *D7.2 | v50.85,74.06 52.24,75.45 52.24,81.38 48.77,84.85 U0.D7
DIRA  (via drill 0.35 pad 0.35)
  Top 0.254: U0.D12 34.55,84.54 32.91,82.9 31.39,82.9 30.59,82.1 30.59,81.14 30.46,81.01 U3.2
  Top 0.305: U9.21 36.06,76 v36.23,76.16 | v28.51,81.02 v28.52,81.01 U3.2
  Bottom 0.305: v36.23,76.16 36.09,76.02 33.51,76.02 v28.51,81.02
DIRB  (via drill 0.35 pad 0.35)
  Top 0.254: U9.17 35.02,73.39 v35.63,72.78
  Top 0.305: U4.2 28.82,68.4 v28.8,68.38
  Bottom 0.254: v28.8,68.38 31.51,68.38 35.63,72.5 v35.63,72.78 37.05,74.2 37.05,76.51 33.08,80.48 33.08,83.59 32.01,84.67 U0.D13
ENA_A  (via drill 0.35)
  Top 0.254: U0.D2 61.46,88.88 60.3,90.04 21.74,90.04 10.52,78.82 v8.91,78.82
  Bottom 0.254: MOTOR_A.1 6.71,71.65 6.2,72.16 6.2,76.11 v8.91,78.82
ENA_B  (via drill 0.35 pad 0.35)
  Top 0.254: v57,91 56.68,91.32 17.32,91.32 v7,81
  Bottom 0.254: v57,91 58.93,89.07 U0.D3 | v7,81 6.41,81 0.99,75.58 0.99,62.09 0.99,34.52 4.86,30.65 6.34,30.65 MOTOR_B.1
ENB_A
  Top 0.254: U0.D4 56.36,86.92 56.36,88.52 55.44,89.44 21.98,89.44 9.85,77.31 7.17,77.31 7.12,77.26 6.22,76.36 6.22,72.95 5.94,72.67 MOTOR_A.2
ENB_B  (via drill 0.35 pad 0.35)
  Top 0.254: v7.12,79.47 18.36,90.71 v43.07,90.71
  Bottom 0.254: v7.12,79.47 6.05,79.47 1.84,75.26 1.84,71.75 4.86,68.73 4.86,39.42 2.23,36.79 2.23,34.74 4.1,32.87 MOTOR_B.2 | v43.07,90.71 44.71,89.07 U0.D8
GND  (via drill 0.35 pad 0.35, 4.2 pad 8)
  Top 0.406: Q1.1 74.88,40.77 v76.05,40.77 | Q3.1 75.89,37.17 v76,37.28
  other vias: 83.62,25.05 2.48,106.76 14.74,107.4 26.26,107.42 34.74,107.4 46.74,107.4 59.74,107.4 74.74,107.4 79.48,24.84 59.79,77.72 58.75,78.77 59.27,77.22 59.27,78.24 59.93,71.12 55.13,79.81 54.64,78.4 56.87,82.79 59.83,76.77 58.74,77.73 68.24,73.75 69.13,73.8 59.18,71.17 70,73.78 70.89,73.78 71.87,73.83 65.65,78.02 65.55,78.73 12.14,94.36 12.13,104.59 12.59,61.31 10.74,59.45 10.51,67.25 5.8,65.52 2.48,65.71 1.47,78.08 6.42,78.11 12.12,82.26 19.12,82.26 24.47,80.79 19.12,77.26 25.08,76.37 24.08,76.37 23.22,76.32 29.3,76.32 29.3,75.32 29.3,74.32 29.3,73.32 29.3,72.32 29.3,71.32 29.3,77.32 29.3,78.32 35.99,82.02 39.35,72.75 40.35,72.75 41.35,72.75 36.02,68.24 41.02,66.24 33.1,67.03 29.64,66.08 29.64,63.08 29.64,60.08 33.64,60.08 33.64,63.08 41.02,63.24 30.02,54.24 30.02,46.24 36.02,46.24 36.02,54.24 35.96,32.44 2.67,17.94 18.99,17.27 28.92,17.27 33.5,17.44 40.67,17.94 42.93,6 20.67,7.94 40.67,11.94 47.67,11.94 49.69,6.41 19.76,26.69 29.53,28.12 38.67,26.94 48.76,27.31 48.77,21.56 46.96,25.13 69.93,29.68 75.89,31.68 76.89,31.68 77.89,31.68 78.89,31.68 79.89,31.68 75.89,30.68 76.89,30.68 75.89,32.68 76.89,32.68 77.89,32.68 78.89,32.68 79.89,32.68 72.67,31.75 71.67,31.75 70.67,31.75 69.67,31.75 79.73,34.16 80.72,36.69 83.95,46.64 83.59,55.02 83.59,62.02 76.68,73.45 71.91,69.52 53.91,69.52 53.91,54.52 63.91,61.52 70.34,49.45 70.42,42.6 64.91,42.52 53.68,40.96 52.99,49.36 55.49,44.56 60.39,41.68 45.89,42.92 45.12,44.86 45.73,47.97 45.73,50.97 45.73,53.97 45.73,58.97 45.73,62.97 45.73,66.97 43.92,74.54 42.73,75.23 43.73,34.97 71.87,74.83 71.87,75.83 71.87,76.83 55.1,81.33 62.25,82.46 55.86,79.85 64.14,82.52 69.67,81.93 76.93,86.52 77.11,92.45 68.96,91.86 55.06,93.28 42.93,102.6 65.56,103.23 1.87,99.68 1.61,90.27 11.87,89.68 30.89,93.03 44.02,93.1 21.19,93.18 22.1,92.35 61.1,19.35 73.1,19.35 82.1,13.35 82.1,3.35 74.97,3.68 60.14,4.49 29.81,3.81 13.88,3.97 2.04,3.63 10.02,50.24 19.71,55.43 82.71,88.43 82.71,98.43 55.86,81.28 55.86,80.56 66.65,83.39 66.94,81.11 71.32,87.3 54.69,77.51 38.85,81.65 40.7,81.65 39.08,84.17 44.68,82.15 44.7,80.63 48.96,80.55 48.96,82.12 63.66,51.11 65.29,88.68 65.14,91.5 61.73,92.66 50.31,93.08 64.87,98.54 36.53,98.07 50.58,98.92 52.03,15.96 55.03,15.96 55.03,11.96 52.03,11.96 55.1,24.35 55.1,29.35 55.1,36.35 1.78,69.93 2.42,82.04 5.47,71.02 8.48,72.66 10.91,72.53 10.09,76.26 13.46,74.97 3.71,76.01 9.32,80.18 5.9,82 3.56,82.83 9.77,92.65 9.64,86.06 8.68,41.41 2.15,46.16 1.88,38.24 6,31.68 6.09,33.86 6.23,38.27 70.67,32.75 69.67,32.75 69.67,30.75 70.67,30.75 28.62,83.75
  pour Top (rank 2, no thermals): 61.29,76.25 59.29,76.25 58.83,77.25 58.83,77.78 60.39,77.76 60.38,76.84 61.29,76.84
  pour Top (isolate 0.1, rank 2): -6,112 94,112 94,-8 -6,-8
  pour Bottom (isolate 0.1, rank 2): -7,113 91,113 91,-7 -7,-7
GREEN  (via drill 0.35 pad 0.35)
  Top 0.254: U1.2 74.02,29.52 v75.07,28.47
  Top 0.305: LED8.C v81.56,22.7
  Bottom 0.254: v75.07,28.47 75.07,26.15 78.52,22.7 v81.56,22.7
MA+
  Top 0.406: C5.1 13.08,72.25 12.6,72.73 F1.1
  Top 0.813: F1.1 7.57,73.72 MOTOR_A.3
MA-
  Top 0.406: C5.2 15.17,71.23 FB2.1
  Top 1.016: FB2.1 10.96,71.23 9.32,69.59 5.2,69.59 2.82,71.97 2.82,73.82 3.71,74.71 MOTOR_A.4
MB+  (via drill 0.35 pad 0.35)
  Top 0.406: C7.1 15.54,28.32 v15.52,28.3 | v10.84,32.84 10.84,33.83 10.9,33.89
  Top 0.813: MOTOR_B.3 10.9,33.89 12.45,33.89 F2.1
  Bottom 0.406: v15.52,28.3 10.98,32.84 v10.84,32.84
MB-
  Top 0.406: FB4.1 C7.2
  Top 1.016: FB4.1 4.75,29.73 2.63,31.85 2.63,34.16 3.38,34.91 MOTOR_B.4
N$1
  Top 0.305: R11.1 84.22,43.51 R12.1 84.24,42.25 84.56,41.93 84.56,41.14 LED7.A
N$2
  Top 0.254: 84.62,22.66 LED8.A
  Top 0.305: R9.1 R1.1 84.3,20.83 84.62,21.15 84.62,22.66
N$4  (via drill 0.35, 0.35 pad 0.35)
  Top 0.305: v84.59,65.72 84.58,65.73 LED6.C | IC10.1 57.52,33.66 v57.86,34
  Bottom 0.305: v84.59,65.72 84.59,48.69 78.4,42.5 75.41,42.5 66.91,34 v57.86,34
N$5
  Top 0.305: R2.1 60.76,29.74 R6.2 59.36,29.72 C17.1 56.7,29.89 IC10.3
N$6  (via drill 0.35, 0.35 pad 0.35)
  Top 0.305: LED6.A 82.82,65.78 v82.81,65.77 | R10.1 R3.1 R13.1 66.9,29.75 67.49,30.34 67.49,35.67 v67.4,35.76
  Bottom 0.305: v82.81,65.77 82.77,65.73 82.77,47.74 78.12,43.09 74.89,43.09 67.56,35.76 v67.4,35.76
N$7  (via drill 0.35 pad 0.35)
  Top 0.406: R4.1 v16.45,70.54 | v16.4,67.86 10.04,61.5 1.65,61.5 1.22,61.93 LED1.C 1.22,67.26 0.71,67.77 0.71,81.45 1.22,81.96 LED2.A
  Bottom 0.406: v16.45,70.54 16.45,67.91 v16.4,67.86
N$12
  Top 0.305: LED3.C 1.22,42.49 | 1.22,42.49 1.22,41.49 0.79,41.06 0.79,27.44 1.22,27.01 LED4.A | 1.41,42.49 1.22,42.49
  Top 0.406: R7.1 14.33,35.28 10.73,35.28 3.52,42.49 1.41,42.49
N$13
  Top 0.813: F1.2 15.19,76.52 FB1.1
N$15
  Top 0.254: U1.7 74.02,33.7 74.51,34.18 R_ISET.2
N$27
  Top 1.016: F2.2 FB3.1
N$30
  Top 0.254: LED5.A R8.1
N$32  (via drill 0.35 pad 0.35)
  Top 0.203: U5.2 | U5.7
  Top 0.254: U5.2 61.65,78.69 62.59,79.62 64,79.62 | U5.7 60.65,74.39 v59.44,74.39 | 64,79.62 CVCC.1 | CVCC.1 65.44,79.62 v65.5,79.68 | CVCC.1 64,79.62 | 64,79.62
  Bottom 0.254: v59.44,74.39 64.74,79.68 v65.5,79.68
N$33
  pour Top (isolate 0.279, no thermals): 63.47,75.69 63.47,74.87 70.39,74.86 70.94,75.41 70.96,76.71 70.39,77.31 63.47,77.31 63.47,76.64 61.64,76.64 61.65,75.69
N$34
  pour Top (isolate 0.254, no thermals): 62.93,77.1 62.93,77.73 64.84,77.73 64.84,78.67 61.99,78.67 61.99,77.1
N$35
  pour Top (isolate 0.254, no thermals): 62.93,75.25 62.93,74.49 64.84,74.49 64.84,73.56 61.81,73.56 61.81,75.25
N$36
  Top 0.203: RFBT.1 | RFBT.1 | RFBT.1 | RFBB.2 62.28,80.43 62,80.43 | U5.3
  Top 0.254: U5.3 61.15,78.89 60.67,79.37 RFBT.1 61.33,80.14 61.63,80.43 62,80.43 62.28,80.43 RFBB.2
N$37
  Top 0.203: 59.23,80 59.27,80.04 RCOMP.2 | 59.23,80 | U5.4
  Top 0.254: U5.4 60.65,77.97 59.27,79.36 59.27,80.04 RCOMP.2 | 59.23,80 CCOMP2.1 | CCOMP2.1
N$38
  Top 0.305: RCOMP.1 57.9,81.05 CCOMP1.1
N$39
  Top 0.203: U5.8 | RLIM.2
  Top 0.254: U5.8 61.15,73.91 60.35,73.11 RLIM.2
OUT1_A
  Top 0.254: U9.1 26.67,78 24.79,78
  Top 0.305: 16.45,74 15.88,74.57 FB1.2
  Top 0.406: R4.2 16.45,74
  Top 1.27: FB1.2 19.68,74.57 23.11,78 24.79,78
  pour Top: 27.94,77.27 27.94,78.77 24.81,78.77 24.81,77.27
OUT1_B
  Top 0.406: R7.2 14.86,31.66 14.89,31.63
  Top 1.27: FB4.2 14.89,31.63 16.23,31.63 26.74,42.14 26.74,69.25
  pour Top: 25.59,71.48 27.9,71.48 27.9,69.22 25.59,69.22
OUT2_A
  Top 0.305: FB2.2 10.85,69.33 10.23,68.71 4.48,68.71 1.92,71.27 1.92,77.2 4.65,79.93 4.65,84.14 3.85,84.94 LED2.C
  Top 0.406: LED1.A 8.79,63.43 12.68,67.32 12.65,67.35 FB2.2
  Top 1.27: FB2.2 17.49,69.33 23.2,75.04 24.52,75.04
  pour Top: 27.92,74.63 27.92,75.46 24.32,75.46 24.32,74.63
OUT2_B  (via drill 0.35, 0.35 pad 0.35)
  Top 0.254: U9.8 24.73,73.39 24.51,73.62
  Top 0.406: v14.35,40.58 14.37,40.56 FB3.2 v14.37,37.07 v14.36,37.06 | v6,45.13 6,45.17 LED3.A | v4.32,23.65 4.3,23.63 LED4.C
  Top 1.27: 24.51,73.62 23.38,72.49 23.38,42.38 19.95,38.95 FB3.2
  Bottom 0.406: v14.35,40.58 9.75,45.18 6,45.2 v6,45.13 | v4.32,23.65 7.93,23.65 9.25,24.97 9.25,33.27 9.77,33.79 11.09,33.79 v14.36,37.06
  pour Top: 27.95,73.33 24.82,73.33 24.82,74.05 27.95,74.05
P32  (via drill 0.35, 0.35 pad 0.35)
  Top 0.254: v52.75,83.63 51.03,81.91 v51.03,80.69 | v44.29,58.52 44.29,43.14 v46.59,40.84 | v38.13,32.03 38.13,33.19 C2.1 | *D9.1 70.9,98.94 v69.75,97.79 | v70.91,93.99 70.91,90.4 v70.86,90.35
  Bottom 0.254: v51.03,80.69 v51.04,80.68 48.35,77.99 48.35,73.82 44.29,69.76 v44.29,58.52 | v46.59,40.84 49.33,40.84 49.34,40.85 50.18,40.01 50.18,37.5 44.71,32.03 v38.13,32.03 | v52.75,83.63 54.43,85.31 67.29,85.31 70.86,88.88 v70.86,90.35 | v69.75,97.79 69.75,95.15 v70.91,93.99
PWMA  (via drill 0.35 pad 0.35)
  Top 0.254: v41.43,80.65 44.64,83.86 50.69,83.86 53.72,86.89 U0.D5
  Top 0.305: U9.23 38.45,77.3 38.68,77.07 v39.14,77.07
  Bottom 0.254: v41.43,80.65 41.43,79.36 v39.14,77.07
PWMB  (via drill 0.35 pad 0.35)
  Top 0.254: U9.15 35.58,72.09 v35.96,71.71
  Bottom 0.254: v35.96,71.71 37.68,73.43 37.68,76.63 33.6,80.71 33.6,82.67 37.09,86.16 U0.D11
RED  (via drill 0.35 pad 0.35)
  Top 0.254: U1.3 74.52,29.89 75.86,28.55 v76.15,28.55
  Top 0.305: LED7.C 82.86,41.08 82.86,39.52 v83.57,38.81
  Bottom 0.254: v76.15,28.55 78.94,28.55 83.55,33.16 83.55,38.79 v83.57,38.81
RESET
  Top 0.254: C2.2 37.11,34.25 36.78,34.58 R5.2
  Top 0.305: R5.2 36.01,38.56 U0.RESET@1
SCL  (via drill 0.35 pad 0.35)
  Top 0.254: v35.82,58.62 v39.86,58.62
  Bottom 0.254: 16,106.61 11.21,106.61 8.78,104.18 8.78,96.31 11.85,93.24 19.6,93.24 21.85,90.99 U0.SCL 21.85,76.37 19.22,73.74 19.22,62.83 23.84,58.21 35.41,58.21 v35.82,58.62 | 16,106.61 32,106.61 | v39.86,58.62 39.83,58.59 39.83,51.64 50.78,40.69 50.78,11.16 55,6.94 | 55,2.57 69.11,2.57 70.97,4.43 70.97,6.93 *D7.6 | A2.6 14.9,105.51 16,106.61 | A3.6 30.74,105.35 32,106.61 | *D10.6 60.16,103.84 57.36,106.64 46.41,106.64 45.36,107.7 39.7,107.7 38.6,106.61 32,106.61 | A0.6 9.8,5.6 12.79,2.61 25.6,2.61 25.64,2.65 | *D6.6 55,6.94 | 55,6.94 55,2.57 | A1.6 25.64,2.65 | 25.64,2.65 25.64,1.93 26.03,1.54 54.37,1.54 55,2.17 55,2.57
SDA  (via drill 0.35 pad 0.35)
  Top 0.254: v35.37,59.48 40.62,59.48 v40.65,59.45 | 24.25,1.94 12.06,1.94 8.23,5.77 8.23,8.54 9.23,9.54 A0.5 | A2.5 16.53,99.46 20.03,102.96 20.03,105.04 21.02,106.03 39,106.03 39,105.96 | 39,105.96 40.1,107.06 45.07,107.06 46.11,106.02 58.95,106.03 61.62,103.36 61.62,100.47 61.66,100.43 60.69,99.46 *D10.5 | A3.5 33.46,99.46 39,105 39,105.96 | *D7.5 67.14,9.54 v65.08,11.6 61,7.52 61,4 57.94,0.94 25.25,0.94 24.25,1.94 | A1.5 25.19,9.54 24.19,8.54 24.19,2 24.25,1.94
  Bottom 0.254: v35.37,59.48 35.18,59.48 34.48,58.78 23.99,58.78 19.74,63.03 19.74,73.5 22.39,76.15 22.39,84.89 U0.SDA 24.39,91.55 21.96,93.98 17.3,93.98 13.88,97.4 A2.5 | v40.65,59.45 40.65,58.37 40.37,58.09 40.37,51.86 51.3,40.93 51.3,22.14 59.22,14.22 | 59.22,14.22 60.59,12.85 63.83,12.85 v65.08,11.6 | *D6.5 56.08,11.08 59.22,14.22
V_B
  pour Top: 75.96,34.76 76.55,34.76 81.16,39.37 81.16,55.59 80.32,56.43 77.19,56.43 75.96,55.2
V_BATT
  Top 0.61: 78.39,71.68 78.57,71.5 | C3.1 82,75 82.4,74.6 B1.P$1
  pour Top: 72.06,32.67 73.93,32.67 73.93,34.44 75.55,34.44 75.49,65.04 80.78,70.33 83.47,70.33 84.43,71.29 84.43,74.13 83.38,75.18 81.06,75.18 72.06,66.18
VCC_1  (via drill 0.35, 0.35 pad 0.35)
  Top 0.305: R9.2 R1.2 81.66,20.83 v81.61,20.88 | R11.2 83.24,45.09 R12.2 83.1,43.49 83.05,43.44 v82.34,43.44
  Bottom 0.254: v81.61,20.88 78.16,20.88 73.81,25.23 v73.81,26.92 | v73.79,28.16 75.11,29.48 78.85,29.48 83.09,33.72 83.09,37.25 81.97,38.37 81.97,43.07 v82.34,43.44
  pour Top: 81.23,30.72 78.79,30.72 77.33,29.26 73.61,29.26 73.61,30.78 71.69,30.78 71.69,26.43 78.21,26.43 80.31,28.53 80.31,29.35 81.23,30.27
VIN  (via drill 0.35)
  Top 0.203: R13.2
  Top 0.254: U5.9 61.65,73.6 62.04,73.21 62.55,73.21 62.67,73.09 CIN2.1 | v35.28,92.13 43.56,92.13 43.56,92.12 60.62,92.12 62.11,90.63 66.26,90.63 71.35,85.54 71.35,80.35 71,80
  Top 0.305: U9.19 35.98,74.69 v36.18,74.5 | R2.2 R10.2 R3.2 R13.2
  Top 0.406: v65.8,35.46 R13.2
  Bottom 0.254: v36.18,74.5 34.12,74.5 25.68,82.94 25.68,88.19 29.62,92.13 v35.28,92.13
  Bottom 0.406: B1.P$2 78,73.97 78,59 69,50 69,38.73 65.82,35.55 65.82,35.48 v65.8,35.46
  pour Top (isolate 0.254): 66.3,80.3 66.3,78.47 72.38,78.47 73.13,77.71 73.12,73.39 72.5,72.75 62.28,72.73 62.28,71.32 73.96,71.33 75.29,72.67 75.28,74.55 75.28,79.43 75.25,79.4 74.36,80.3
  pour Top: 84.32,76.41 74.06,76.41 74.06,80.3 83.7,80.3 84.32,79.68

### Text on the board
tNames: B1 | P1
bNames: P2 | P4 | P1 | P3
tValues: L298P013TR